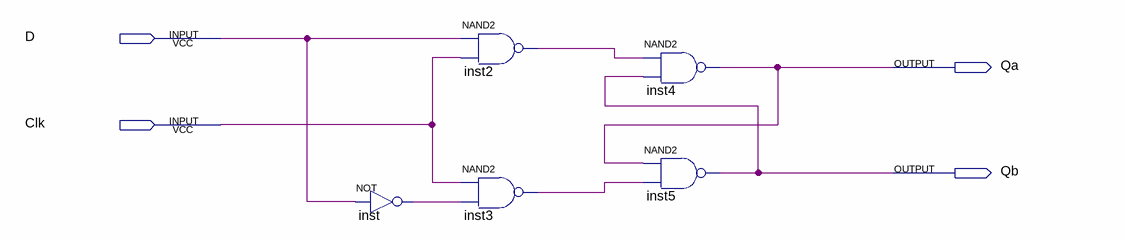
[diagram p0: schematic sheet]
// Quartus schematic proj2.bdf as structural Verilog: 5 symbols, 4 pins
module proj2 (
  input  D,
  input  Clk,
  output Qa,
  output Qb
);

  wire inst2_out, inst3_out, inst_out;

  not inst (inst_out, D);
  nand inst2 (inst2_out, D, Clk);
  nand inst3 (inst3_out, Clk, inst_out);
  nand inst4 (Qa, inst2_out, Qb);
  nand inst5 (Qb, Qa, inst3_out);
endmodule
